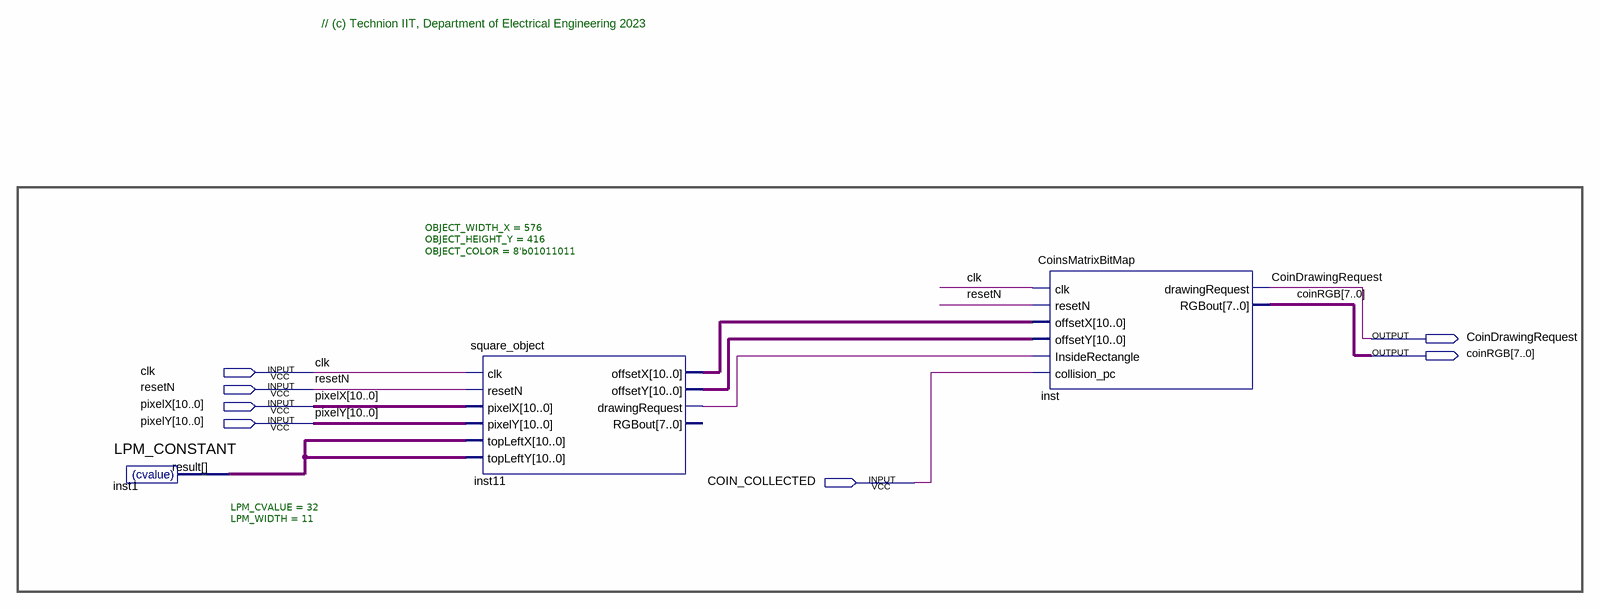
[diagram p0: schematic sheet]
// Quartus schematic COIN_DISPLAY.bdf as structural Verilog: 3 symbols, 7 pins
module COIN_DISPLAY (
  input  clk,
  input  resetN,
  input  [10:0] pixelX,
  input  [10:0] pixelY,
  input  COIN_COLLECTED,
  output CoinDrawingRequest,
  output [7:0] coinRGB
);

  wire inst11_drawingrequest;
  wire [10:0] inst1_result, inst11_offsetx, inst11_offsety;

  LPM_CONSTANT #(.LPM_CVALUE(32), .LPM_WIDTH(11)) inst1 (.result(inst1_result));
  square_object #(.OBJECT_WIDTH_X(576), .OBJECT_HEIGHT_Y(416), .OBJECT_COLOR(8'b01011011)) inst11 (
    .clk(clk), .resetN(resetN), .pixelX(pixelX), .pixelY(pixelY), .topLeftX(inst1_result),
    .topLeftY(inst1_result), .offsetX(inst11_offsetx), .offsetY(inst11_offsety),
    .drawingRequest(inst11_drawingrequest));  // open: RGBout
  CoinsMatrixBitMap inst (
    .clk(clk), .resetN(resetN), .offsetX(inst11_offsetx), .offsetY(inst11_offsety),
    .InsideRectangle(inst11_drawingrequest), .collision_pc(COIN_COLLECTED),
    .drawingRequest(CoinDrawingRequest), .RGBout(coinRGB));

  // Notes on the sheet:
  //   // (c) Technion IIT, Department of Electrical Engineering 2023
endmodule
